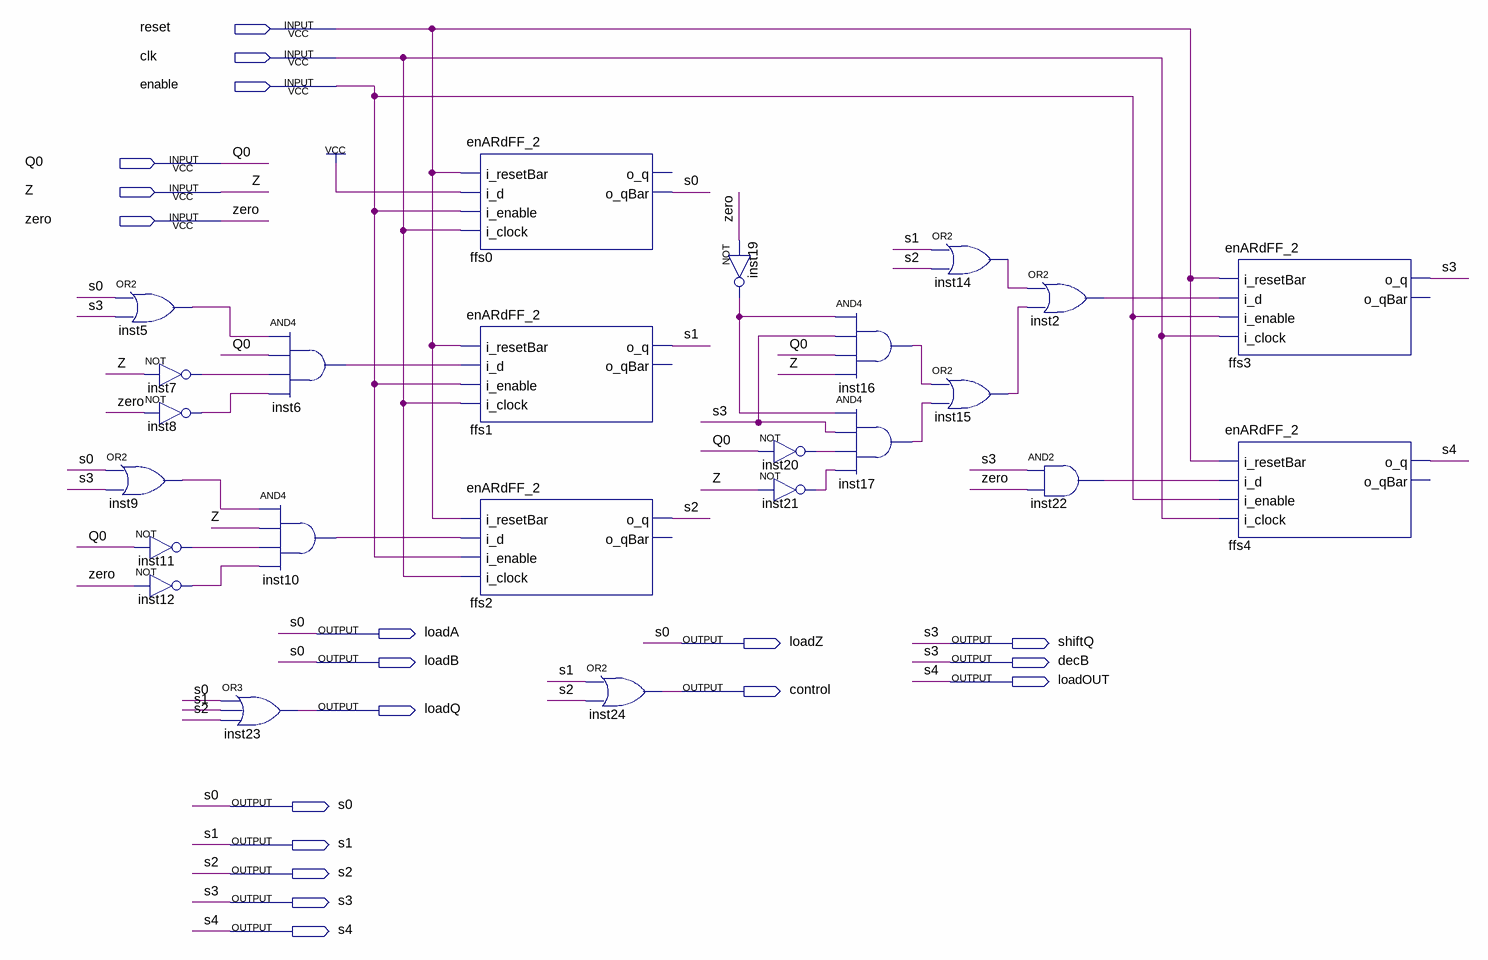
[diagram p0: schematic sheet]
// Quartus schematic controllogic.bdf as structural Verilog: 24 symbols, 19 pins
module controllogic (
  input  reset,
  input  clk,
  input  enable,
  input  Q0,
  input  Z,
  input  zero,
  output loadA,
  output loadZ,
  output shiftQ,
  output loadB,
  output decB,
  output loadOUT,
  output control,
  output loadQ,
  output s0,
  output s1,
  output s2,
  output s3,
  output s4
);

  wire inst2_out, inst5_out, inst6_out, inst7_out, inst8_out, inst9_out, inst10_out, inst11_out, inst12_out,
       inst14_out, inst15_out, inst16_out, inst17_out, inst19_out, inst20_out, inst21_out, inst22_out;

  or inst5 (inst5_out, loadA, decB);
  or inst9 (inst9_out, loadA, decB);
  not inst7 (inst7_out, Z);
  not inst8 (inst8_out, zero);
  not inst11 (inst11_out, Q0);
  not inst12 (inst12_out, zero);
  and inst6 (inst6_out, inst5_out, Q0, inst7_out, inst8_out);
  and inst10 (inst10_out, inst9_out, Z, inst11_out, inst12_out);
  or inst23 (loadQ, loadA, s1, s2);
  enARdFF_2 ffs0 (.i_resetBar(reset), .i_d(1'b1), .i_enable(enable), .i_clock(clk), .o_qBar(loadA));  // open: o_q
  enARdFF_2 ffs1 (.i_resetBar(reset), .i_d(inst6_out), .i_enable(enable), .i_clock(clk), .o_q(s1));  // open: o_qBar
  enARdFF_2 ffs2 (.i_resetBar(reset), .i_d(inst10_out), .i_enable(enable), .i_clock(clk), .o_q(s2));  // open: o_qBar
  or inst24 (control, s1, s2);
  not inst19 (inst19_out, zero);
  not inst20 (inst20_out, Q0);
  not inst21 (inst21_out, Z);
  and inst16 (inst16_out, inst19_out, decB, Q0, Z);
  and inst17 (inst17_out, inst19_out, decB, inst20_out, inst21_out);
  or inst14 (inst14_out, s1, s2);
  or inst15 (inst15_out, inst16_out, inst17_out);
  or inst2 (inst2_out, inst14_out, inst15_out);
  and inst22 (inst22_out, decB, zero);
  enARdFF_2 ffs3 (.i_resetBar(reset), .i_d(inst2_out), .i_enable(enable), .i_clock(clk), .o_q(decB));  // open: o_qBar
  enARdFF_2 ffs4 (
    .i_resetBar(reset), .i_d(inst22_out), .i_enable(enable), .i_clock(clk), .o_q(loadOUT));  // open: o_qBar

  assign loadB = loadA;
  assign loadZ = loadA;
  assign s0 = loadA;
  assign s3 = decB;
  assign s4 = loadOUT;
  assign shiftQ = decB;
endmodule
